# EAGLE design Adafruit DPI Kippah (EAGLE 6.6.0)
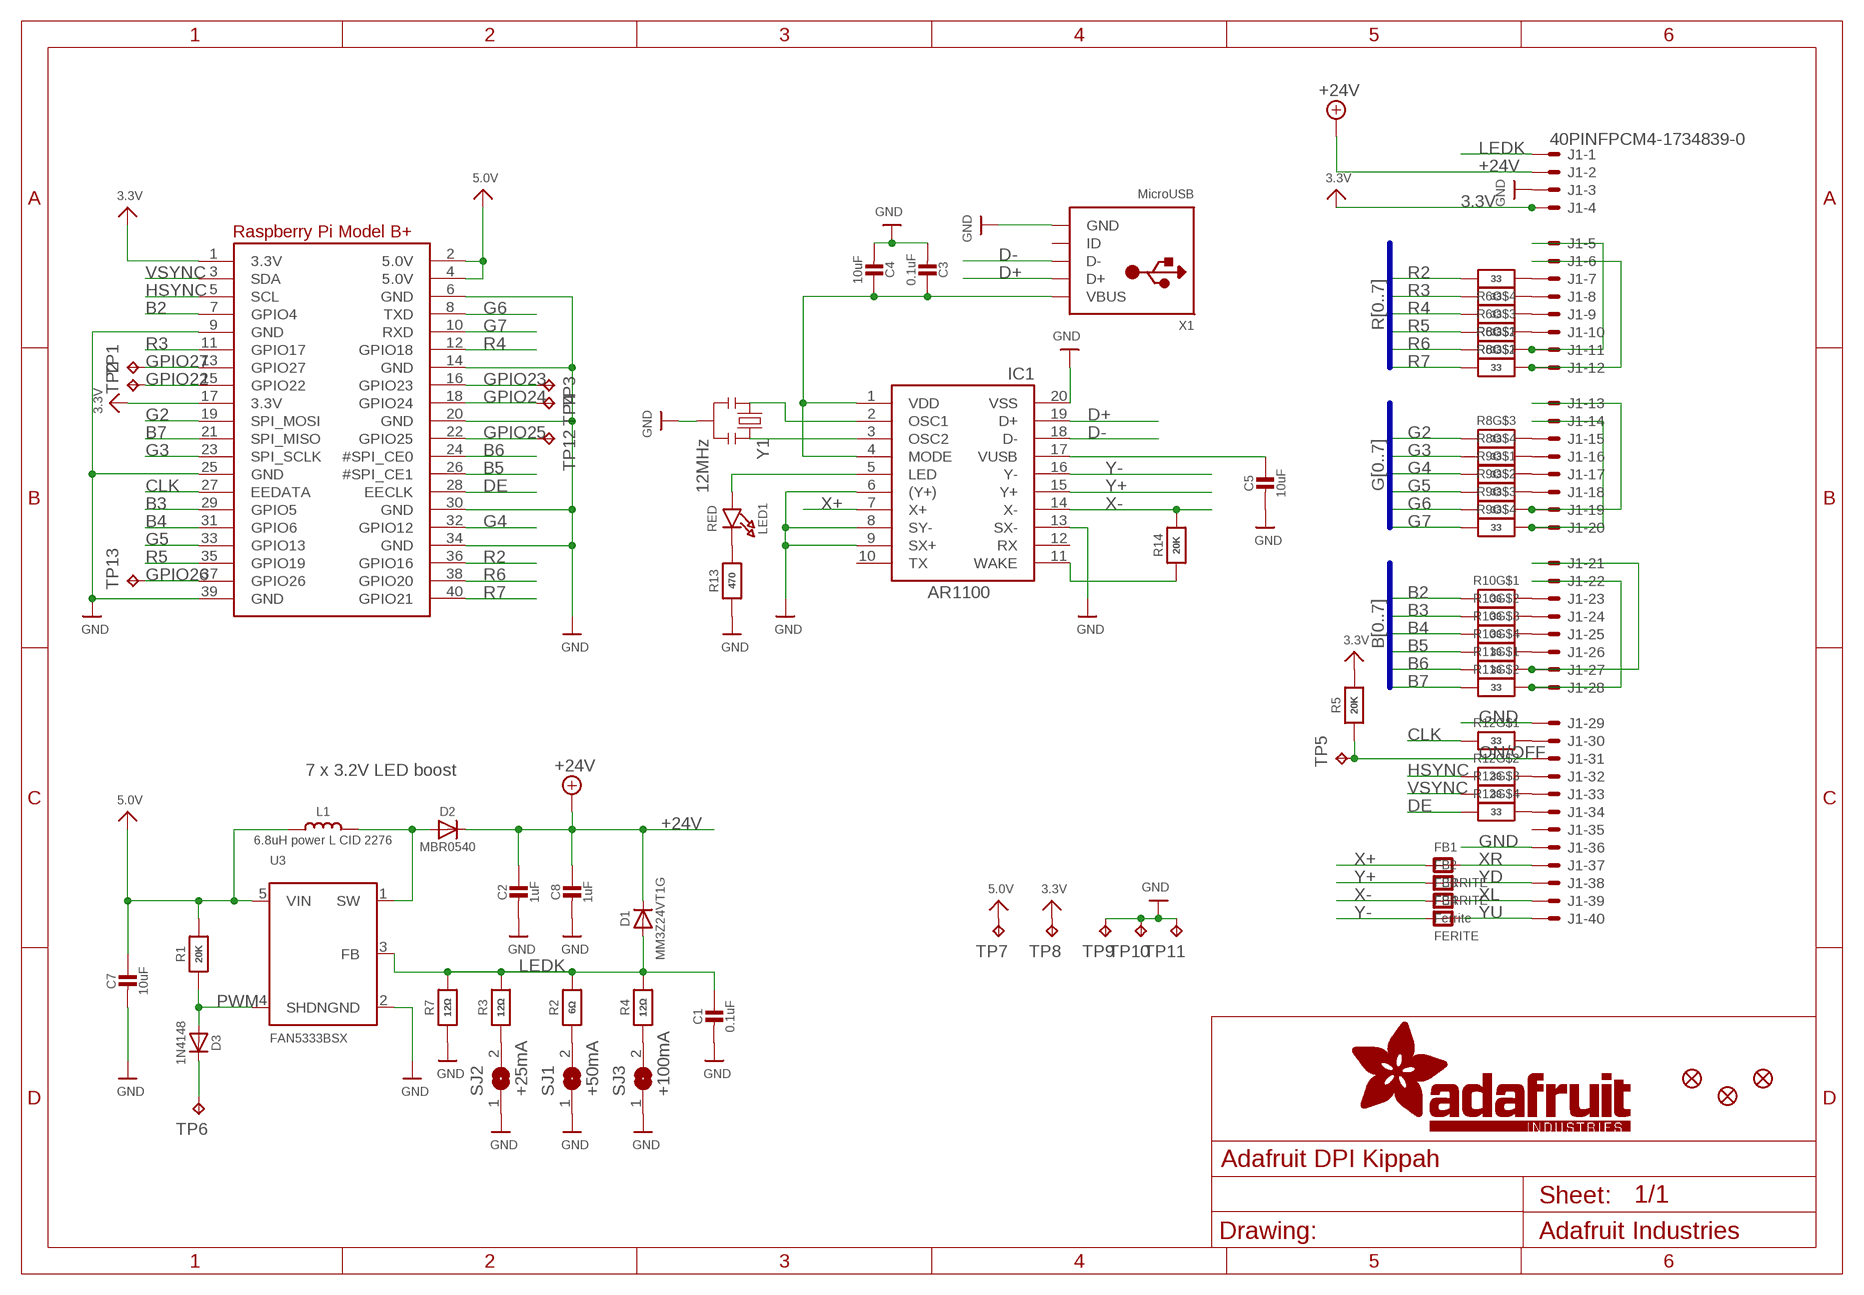
[diagram p0: schematic, sheet 1]

## Parts
C1  0.1uF  CAP_CERAMIC0805-NOOUTLINE  [0805-NO]
C2  1uF  CAP_CERAMIC_0805MP  [_0805MP]
C3  0.1uF  CAP_CERAMIC0805-NOOUTLINE  [0805-NO]
C4  10uF  CAP_CERAMIC0805-NOOUTLINE  [0805-NO]
C5  10uF  CAP_CERAMIC0805-NOOUTLINE  [0805-NO]
C7  10uF  CAP_CERAMIC0805-NOOUTLINE  [0805-NO]
C8  1uF  CAP_CERAMIC0805-NOOUTLINE  [0805-NO]
D1  MM3Z24VT1G  DIODESMA  [SMADIODE]
D2  MBR0540  DIODESOD-123  [SOD-123]
D3  1N4148  DIODESOD-323  [SOD-323]
FB1  FERRITE  FERRITE_0805MP  [_0805MP]
FB2  FERRITE  FERRITE_0805MP  [_0805MP]
FB3  Ferrite  FERRITE_0805MP  [_0805MP]
FB4  FERITE  FERRITE_0805MP  [_0805MP]
FID1  FIDUCIAL""  [FIDUCIAL_1MM]
FID2  FIDUCIAL""  [FIDUCIAL_1MM]
FID3  FIDUCIAL""  [FIDUCIAL_1MM]
IC1  AR1100_SSOP  [TSSOP20-5.3MMBODY]
J1  40PINFPCM4-1734839-0  [4-1734839-0]
L1  6.8uH power L CID 2276  INDUCTORNR5040  [INDUCTOR_5X5MM_NR5040_NOTHERMALS]
LED1  RED  LED0805_NOOUTLINE  [CHIPLED_0805_NOOUTLINE]
R1  20K  RESISTOR0805_NOOUTLINE  [0805-NO]
R2  6Ω  RESISTOR0805_NOOUTLINE  [0805-NO]
R3  12Ω  RESISTOR0805_NOOUTLINE  [0805-NO]
R4  12Ω  RESISTOR0805_NOOUTLINE  [0805-NO]
R5  20K  RESISTOR_0805MP  [_0805MP]
R6  33  RESISTOR_4PACK  [RESPACK_4X0603]
R7  12Ω  RESISTOR0805_NOOUTLINE  [0805-NO]
R8  33  RESISTOR_4PACK  [RESPACK_4X0603]
R9  33  RESISTOR_4PACK  [RESPACK_4X0603]
R10  33  RESISTOR_4PACK  [RESPACK_4X0603]
R11  33  RESISTOR_4PACK  [RESPACK_4X0603]
R12  33  RESISTOR_4PACK  [RESPACK_4X0603]
R13  470  RESISTOR0805_NOOUTLINE  [0805-NO]
R14  20K  RESISTOR0805_NOOUTLINE  [0805-NO]
RPI1  RASPBERRYPI_BPLUS-SMT+SLOTS  [PI_HAT_SMT_SLOTS]
SJ1  +50mA  SOLDERJUMPER  [SOLDERJUMPER_ARROW_NOPASTE]
SJ2  +25mA  SOLDERJUMPER  [SOLDERJUMPER_ARROW_NOPASTE]
SJ3  +100mA  SOLDERJUMPER  [SOLDERJUMPER_ARROW_NOPASTE]
TP1  TPTP15SQ  [TP15SQ]
TP2  TPTP15SQ  [TP15SQ]
TP3  TPTP15SQ  [TP15SQ]
TP4  TPTP15SQ  [TP15SQ]
TP5  TPTP15SQ  [TP15SQ]
TP6  TPTP15SQ  [TP15SQ]
TP7  TPTP15SQ  [TP15SQ]
TP8  TPTP15SQ  [TP15SQ]
TP9  TPTP15SQ  [TP15SQ]
TP10  TPTP15SQ  [TP15SQ]
TP11  TPTP15SQ  [TP15SQ]
TP12  TPTP15SQ  [TP15SQ]
TP13  TPTP15SQ  [TP15SQ]
U3  FAN5333BSX  FAN5331  [SOT23-5@1]
X1  MicroUSB  USBMICRO_20329  [4UCONN_20329]
Y1  12MHz  RESONATORSMD  [RESONATOR-SMD]

## Nets
3.3V: J1.4 R5.2 RPI1.1(3.3V) RPI1.17(3.3V) TP8.TP
5.0V: C7.1 L1.P$1 R1.2 RPI1.2(5.0V) RPI1.4(5.0V) TP7.TP U3.5(VIN)
+24V: C2.1 C8.1 D1.C D2.C J1.2
B2: R10.1 RPI1.7(GPIO4)
B3: R10.2 RPI1.29(GPIO5)
B4: R10.3 RPI1.31(GPIO6)
B5: R10.4 RPI1.26(#SPI_CE1)
B6: R11.1 RPI1.24(#SPI_CE0)
B7: R11.2 RPI1.21(SPI_MISO)
CLK: R12.1 RPI1.27(EEDATA)
D+: IC1.19(D+) X1.D+
D-: IC1.18(D-) X1.D-
DE: R12.4 RPI1.28(EECLK)
G2: R8.3 RPI1.19(SPI_MOSI)
G3: R8.4 RPI1.23(SPI_SCLK)
G4: R9.1 RPI1.32(GPIO12)
G5: R9.2 RPI1.33(GPIO13)
G6: R9.3 RPI1.8(TXD)
G7: R9.4 RPI1.10(RXD)
GND: C1.2 C2.2 C3.2 C4.2 C5.2 C7.2 C8.2 IC1.6((Y+)) IC1.8(SY-) IC1.9(SX+) IC1.13(SX-) IC1.20(VSS) J1.3 J1.29 J1.36 R7.1 R13.1 RPI1.6(GND) RPI1.9(GND) RPI1.14(GND) RPI1.20(GND) RPI1.25(GND) RPI1.30(GND) RPI1.34(GND) RPI1.39(GND) SJ1.1 SJ2.1 SJ3.1 TP9.TP TP10.TP TP11.TP U3.2(GND) X1.BASE@1(GND) X1.BASE@2(GND) X1.GND X1.SPRT@1(GND) X1.SPRT@2(GND) X1.SPRT@3(GND) X1.SPRT@4(GND) Y1.2
GPIO22: RPI1.15(GPIO22) TP2.TP
GPIO23: RPI1.16(GPIO23) TP3.TP
GPIO24: RPI1.18(GPIO24) TP4.TP
GPIO25: RPI1.22(GPIO25) TP12.TP
GPIO26: RPI1.37(GPIO26) TP13.TP
GPIO27: RPI1.13(GPIO27) TP1.TP
HSYNC: R12.2 RPI1.5(SCL)
LEDK: C1.1 D1.A J1.1 R2.2 R3.2 R4.2 R7.2 U3.3(FB)
N$1: R2.1 SJ1.2
N$2: R3.1 SJ2.2
N$3: R4.1 SJ3.2
N$4: J1.6 J1.12 R8.7
N$5: D2.A L1.P$2 U3.1(SW)
N$6: J1.5 J1.11 R8.8
N$7: J1.10 R6.1
N$8: J1.9 R6.2
N$9: J1.8 R6.3
N$10: J1.7 R6.4
N$11: J1.15 R8.6
N$12: J1.16 R8.5
N$13: J1.17 R9.8
N$14: J1.18 R9.7
N$15: J1.13 J1.19 R9.6
N$16: J1.14 J1.20 R9.5
N$17: J1.23 R10.8
N$18: J1.24 R10.7
N$19: J1.25 R10.6
N$20: J1.26 R10.5
N$21: J1.21 J1.27 R11.8
N$22: J1.22 J1.28 R11.7
N$23: J1.30 R12.8
N$24: J1.32 R12.7
N$25: J1.33 R12.6
N$26: J1.34 R12.5
N$27: D3.C TP6.TP
N$28: IC1.5(LED) LED1.A
N$29: LED1.C R13.2
N$31: IC1.11(WAKE) R14.1
N$33: IC1.3(OSC2) Y1.3
N$34: IC1.2(OSC1) Y1.1
ON/OFF: J1.31 R5.1 TP5.TP
PWM: D3.A R1.1 U3.4(SHDN)
R2: R6.5 RPI1.36(GPIO16)
R3: R6.6 RPI1.11(GPIO17)
R4: R6.7 RPI1.12(GPIO18)
R5: R6.8 RPI1.35(GPIO19)
R6: R8.1 RPI1.38(GPIO20)
R7: R8.2 RPI1.40(GPIO21)
VBUS: C3.1 C4.1 IC1.1(VDD) IC1.4(MODE) X1.VBUS
VSYNC: R12.3 RPI1.3(SDA)
VUSB: C5.1 IC1.17(VUSB)
X+: FB1.1 IC1.7(X+)
X-: FB3.1 IC1.14(X-) R14.2
XL: FB3.2 J1.39
XR: FB1.2 J1.37
Y+: FB2.1 IC1.15(Y+)
Y-: FB4.1 IC1.16(Y-)
YD: FB2.2 J1.38
YU: FB4.2 J1.40
Unconnected: IC1.10(TX) IC1.12(RX) J1.35 R11.3 R11.4 R11.5 R11.6 X1.ID

## Buses
R[0..7]
G[0..7]
B[0..7]

## Notes on the sheet
- 7 x 3.2V LED boost

## Library data of the parts
C1-C5 C7 C8 = microbuilder:CAP_CERAMIC: Ceramic Capacitors For new designs, use the packages preceded by an '_' character since they are more reliable: The following footprints should be used on most boards: _0402 - Standard footprint for regular board layouts _0603 - Standard footprint for regular board layouts _0805 - Standard footprint for regular board layouts _1206 - Standard footprint for regular board layouts For extremely tight-pitch boards where space is at a premium, the following 'micro-pitch' footprints can be used (smaller pads, no silkscreen outline, etc.): _0402MP - Micro-pitch footprint for very dense/compact boards _0603MP - Micro-pitch footprint for very dense/compact boards _0805MP - Micro-pitch footprint for very dense/compact boards _1206MP - Micro-pitch footprint for very dense/compact boards
D1-D3 = microbuilder:DIODE: Diode SMA Model Volts Amps Type Vf Ir Digikey # Notes SSA34-E3 40V 3A Schottky 480mV @ 3A 200uA @ 40V SSA34-E3/61TGITR-ND CDBA120-G 20V 1A Schottky 500mV @ 1A 500uA @ 20V 641-1014-6-ND REEL MBRA210 10V 2A Schottky 350mV @ 2A 700uA @ 10V MBRA210LT3 SOD-123 Model Volts Amps Type Vf Ir Order # Notes BAT54T1G 30V 200mA Schottky 800mV @ 200mA 2uA @ 25V BAT54T1GOSTR-ND B0530W 30V 500mA Schottky 430mV @ 500mA 130uA @ 30V B0530W-FDICT-ND REEL MBR120 20V 1A Schottky 340mV @ 1A MBR120VLSFT1GOSCT-ND SOD-323 Model Volts Amps Type Vf Ir Order # Notes PMEG2005EJ 20V 500mA Schottky 355mV @ 500mA 568-4110-1-ND ZLLS410 10V 570mA Schottky 380mV @ 570mA ZLLS410CT-ND 1N4148WS 75V 150mA Silicon/Simple 1V 1N4148WSFSCT-ND REEL SOD-523 Model Volts Amps Type Vf Ir Order # Notes BAT54XV2 30V 200mA Schottky 0.8V @ 100mA BAT54XV2CT-ND TB751S 30V 30mA Schottky RB751S-40TE61CT-ND SOT23-R/W (R = Solder Paste/Reflow Ovens, W = Hand-Soldering) Model Volts Amps Type Vf Ir Order # Notes BAT54FILM 40V 300mA Schottky 497-7162-1-ND POWERDI-5 Model Volts Amps Type Vf Ir Order # Notes PDS560 60V 5A Schottky 670mV @ 5A 150uA @ 60V PDS560DICT-ND
FB1-FB4 = microbuilder:FERRITE: Ferrite Bead 0603 MMZ1608B121C - 120 Ohm @ 100MHz, 600mA, 0.15 Ohm DC Resistance - Digikey: 445-2164-1-ND BK1608HW121-T - 120 Ohm, 600mA Ferrite Chip - Digikey: 587-1876-2-ND 0805 HZ0805B272R-10 - 2.7K Ohm @ 100MHz, 200mA, 0.8 Ohm DC Resistance - Digikey: 240-2504-1-ND (see also Murata BLM21BD272SN1L) MMZ2012Y152B - 1.5K Ohm @ 100MHz, 500mA, 0.4 Ohm DC Resistance - Digikey: 445-1560-1-ND - Mainly for high frequency (80-400MHz) MMZ2012R102A - 1K Ohm @ 100MHz, 500mA, 0.3 Ohm DC Resistance - Digikey: 445-1555-2-ND - More general purpose (10-200MHz)
FID1-FID3 = microbuilder:FIDUCIAL: Fiducial Alignment Points Various fiducial points for machine vision alignment.; BOM: EXCLUDE
IC1 = microbuilder:AR1100
J1 = adafruit:40PINFPC: OMRON FPC Connector Source : http://www.omron.com/ecb/products/pdf/fpc.pdf XF2M-4015-rev is good for connecting up 'PSP' SHARP LQ043 LCDs
L1 = microbuilder:INDUCTOR: Inductors 0603: 10nH Ceramic Inductor - microwire antenna/RF (Digikey: 712-1434-2-ND) 0805: 560nH Ceramic Inductor - RF (Digikey: 553-1047-1-ND) 270nH Ceramic Inductor - Q = 40@250MHz, +-5%, 1 Ohm DC Resistance (Digikey: 535-10506-2-ND) 1007 (2518 Metric) SMT: 10µH 10% 250mOhm 820mA 1007 Inductor (Digikey: 587-2189-1-ND) 22µH 10% 500mOhm 580mA 1007 Inductor (Digikey: 587-2190-1-ND) 47µH 10% 950mOhm 420mA 1007 Inductor (Digikey: 587-2191-1-ND) 47µH 5% 100mOhm 1A 1008 Inductor (Digikey: 732-1816-1-ND) 5.0x5.0mm (Taiyo Yuden NR5040 Series) 6.8µH 20% 2.3A 64mOhm Inductor (Digikey: 587-2374-2-ND) 5.0x5.0mm (TDK VLC5045 Series) 4.7µH 20% 3.3A 34mOhm Inductor (Digikey: 445-6526-1-ND) 6.8µH 20% 2.7A 46mOhm Inductor (Digikey: 445-6527-1-ND) 6.0x6.0mm (TDK VLC6045 Series) 4.7µH 20% 3.8A 27mOhm Inductor (Digikey: 445-6538-2-ND) 6.8µH 20% 3A 41mOhm Inductor (Digikey: 445-6540-1-ND) 6.2µH 30% 2.2A 45mOhm Inductor (Digikey: SRR5028-6R2YCT-ND) - Not TDK VLC6045 but footprint should match 6.0x6.0mm (TDK SLF6045 Series) 6.8uH 30% 2A 33mOhm Inductor (Digikey: 445-4572-1-ND, Mouser: 810-SLF645T6R8N2R0PF) 6.0x6.0mm (Sumida CDRH5D28 Series) 6.2uH 30% 1.8A 45mOhm Inductor (Digikey: 308-1542-1-ND) Taiyo Yuden NR3015T2R2M - 2.2uH 20% 1.5A (Digikey: 587-1648-2-ND, Mouser: 963-NR3015T2R2M) - Used with TI TPS62172 CoilCraft RFID Transponder Coil - MA5532-AE (For use with AS3935 Lightning Sensor) Vishay IHLP 1.0uH Molded Inductor - 24mOhm DCR, 5A, +/-20%, -55°C-125°C (Digikey: 541-1319-1-ND)
LED1 = microbuilder:LED: LED 0603 - 0603 Surface Mount Package 2mA: Green LED - Low Power (3.9mcd, 2ma, 1.7Vf) - Digikey: 475-2709-2-ND Orange LED - Low Power (9.8mcd, 2ma, 1.8Vf) - Digikey: 475-1194-2-ND Red LED - Low Power (5mcd, 2ma, 1.8Vf) - Digikey: 475-1195-2-ND Yellow LED - Low Power (7mcd, 2ma, 1.8Vf) - Digikey: 475-1196-2-ND 5mA: Blue LED - Low Power (17mcd, 5ma, 2.9Vf) - Digikey: LNJ937W8CRACT-ND 0805 - 0805 Surface Mount Package 2mA: Red LED (8.8mcd, 2mA, 1.8Vf, Clear) - Low Power [Digikey: 475-2510-1-ND] Green LED (5mcd, 2mA, 1.8Vf, Clear) - Low Power [Digikey: 475-2730-1-ND] Yellow LED (11.3mcd, 2mA, 1.8Vf, Clear) - Low Power [Digikey: 475-2555-1-ND] 20mA: Red LED (104mcd, 20mA, Diffused) - LS R976 [Digikey: 475-1278-6-ND] Red LED (12mcd, 20mA, 2.0Vf, Clear) - APT2012EC [Digikey: 754-1128-1-ND] Green LED (15mcd, 20mA, 2.2Vf, Clear) - APT2012GC [Digikey: 754-1131-1-ND] Orange LED (160mcd, 20mA, 2.1Vf, Clear) - APT2012SECK [Digikey: 754-1130-1-ND] 1206 - 1206 Surface Mount Package Green LED (26mcd, 20mA, Diffused) - LG N971 [Digikey: 475-1407-6-ND] Red LED (15mcd, 20mA, Diffused) - LH N974 [Digikey: 475-1416-6-ND] Cree - Cree High-Power Surface Mount LEDs XPEBWT-L1-0000-00D50 - White 111lm 350mA 2.9Vf 6200K 110° XTEAWT-00-0000-00000LEE3 - White 114lm 350mA 2.85Vf 5000K 115° Everlight - Everlight 45-21 Series Surface Mount LEDs 45-21/QK2C-B2832AC2CB2/2T - Warm White 2000mcd 20mA 3.25Vf 3050K 120° 45-21/LK2C-B38452C4CB2/2T - Nuetral White 2000mcd 20mA 3.25Vf 4150K 120° 45-21/LK2C-B50634C6CB2/2T - Cold White 2200mcd 20mA 3.25Vf 5650K 120° PLCC2 Reverse Mount LS T77K-J1L2-1-0-2-R18-Z - Red 11.25mcd 2mA 1.8Vf 630nm 120° LO T77K-L1M2-24-Z - Orange 19.6mcd 2mA 1.8Vf 606nm 120° LY T77K-K2M1-26-Z - Yellow 15.7mcd 2mA 1.8Vf 587nm 120°
R1-R5 R7 R13 R14 = microbuilder:RESISTOR: Resistors For new designs, use the packages preceded by an '_' character since they are more reliable: The following footprints should be used on most boards: _0402 - Standard footprint for regular board layouts _0603 - Standard footprint for regular board layouts _0805 - Standard footprint for regular board layouts _1206 - Standard footprint for regular board layouts For extremely tight-pitch boards where space is at a premium, the following 'micro-pitch' footprints can be used (smaller pads, no silkscreen outline, etc.): _0402MP - Micro-pitch footprint for very dense/compact boards _0603MP - Micro-pitch footprint for very dense/compact boards _0805MP - Micro-pitch footprint for very dense/compact boards _1206MP - Micro-pitch footprint for very dense/compact boards
R6 R8-R12 = microbuilder:RESISTOR_4PACK: Resistor Packs (4 resistors) 4 x 0603 10K 1/16W - Digikey: YC164J-10KCT-ND
RPI1 = microbuilder:RASPBERRYPI_BPLUS
SJ1-SJ3 = microbuilder:SOLDERJUMPER: SMD Solder JUMPER Solder the two pads together to create a connection, or remove the solder to break it. REFLOW - Use this footprint for solder paste and reflow ovens. WAVE - Use this footprint for hand-soldering (larger pads). CLOSED - Has a trace between the two pads to ensure it is closed by default. The trace needs to be cut to disable the jumper, and can be closed again by creating a solder bridge between the two pads.; BOM: EXCLUDE
TP1-TP13 = testpad:TP: Test pad
U3 = microbuilder:FAN5331: FAN5331 - LED/OLED 20V Boost Converter Digikey: FAN5331SXCT-ND
X1 = microbuilder:USB: USB Connectors USBMINIB - Surface Mount Female Mini-B USB Connector 4UConnector: 06564
Y1 = SparkFun:RESONATOR: Resonator Small SMD resonator. This is the itty bitty 10/20MHz resonators with built in caps. CSTCE10M0G55 and CSTCE20M0V53. Footprint has been reviewed closely but hasn't been tested yet.

## Board
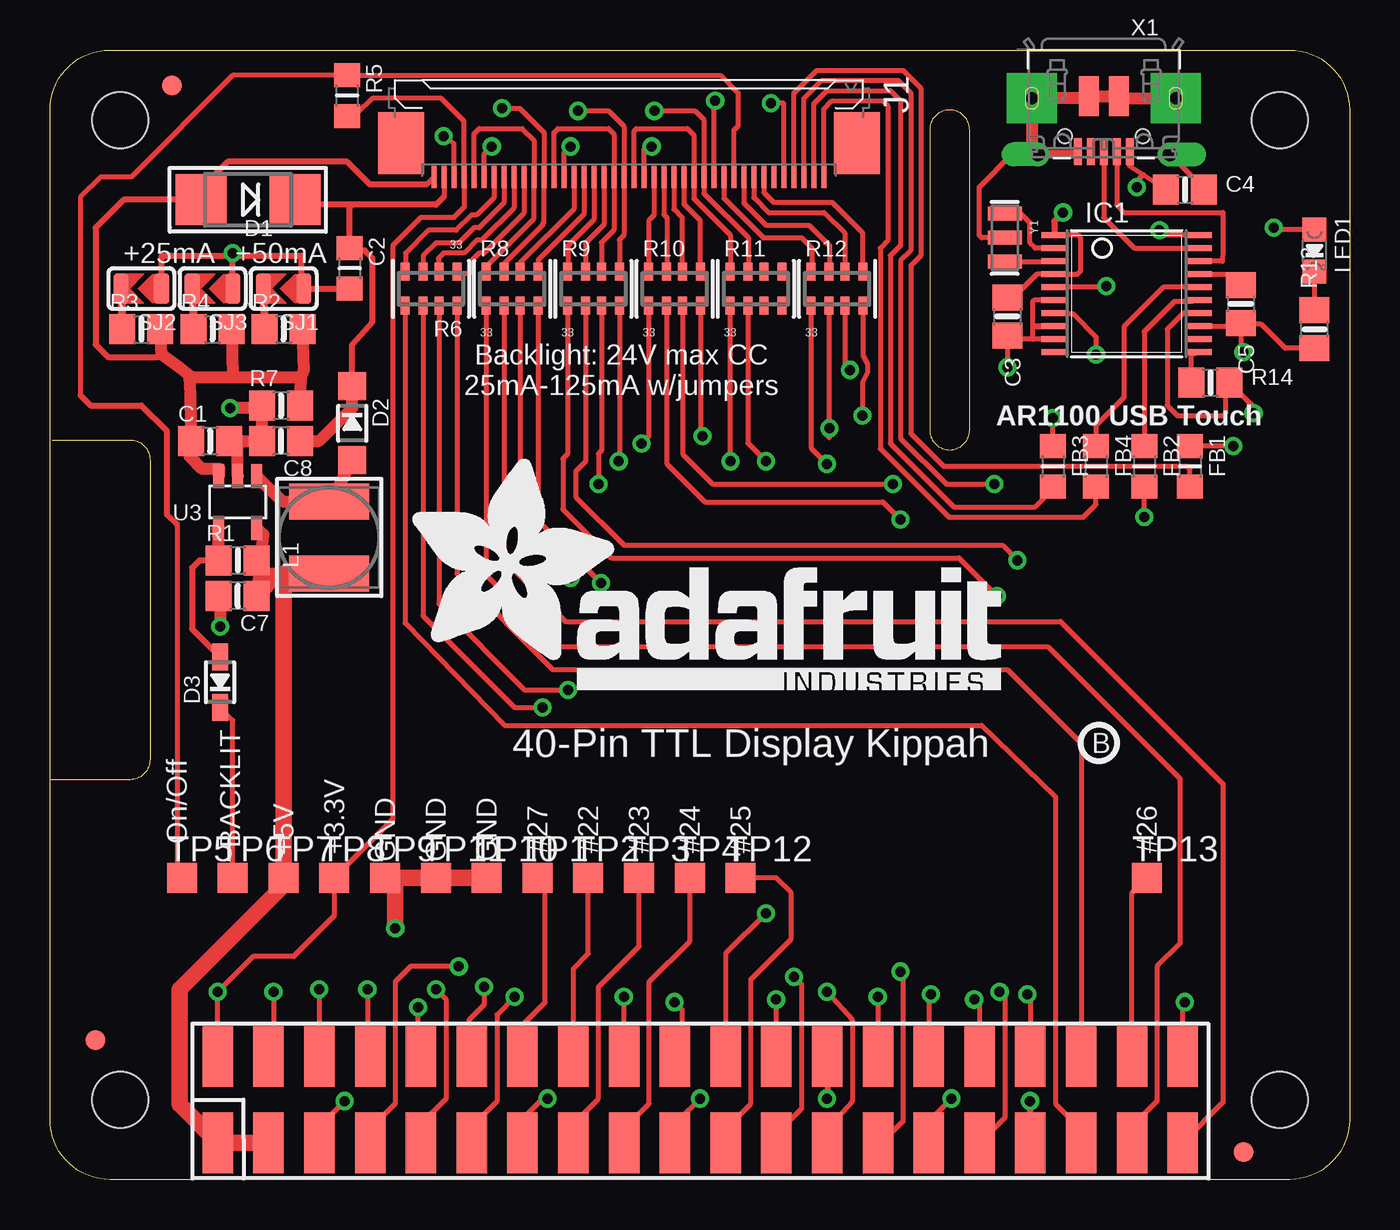
[diagram p1: board, top side]
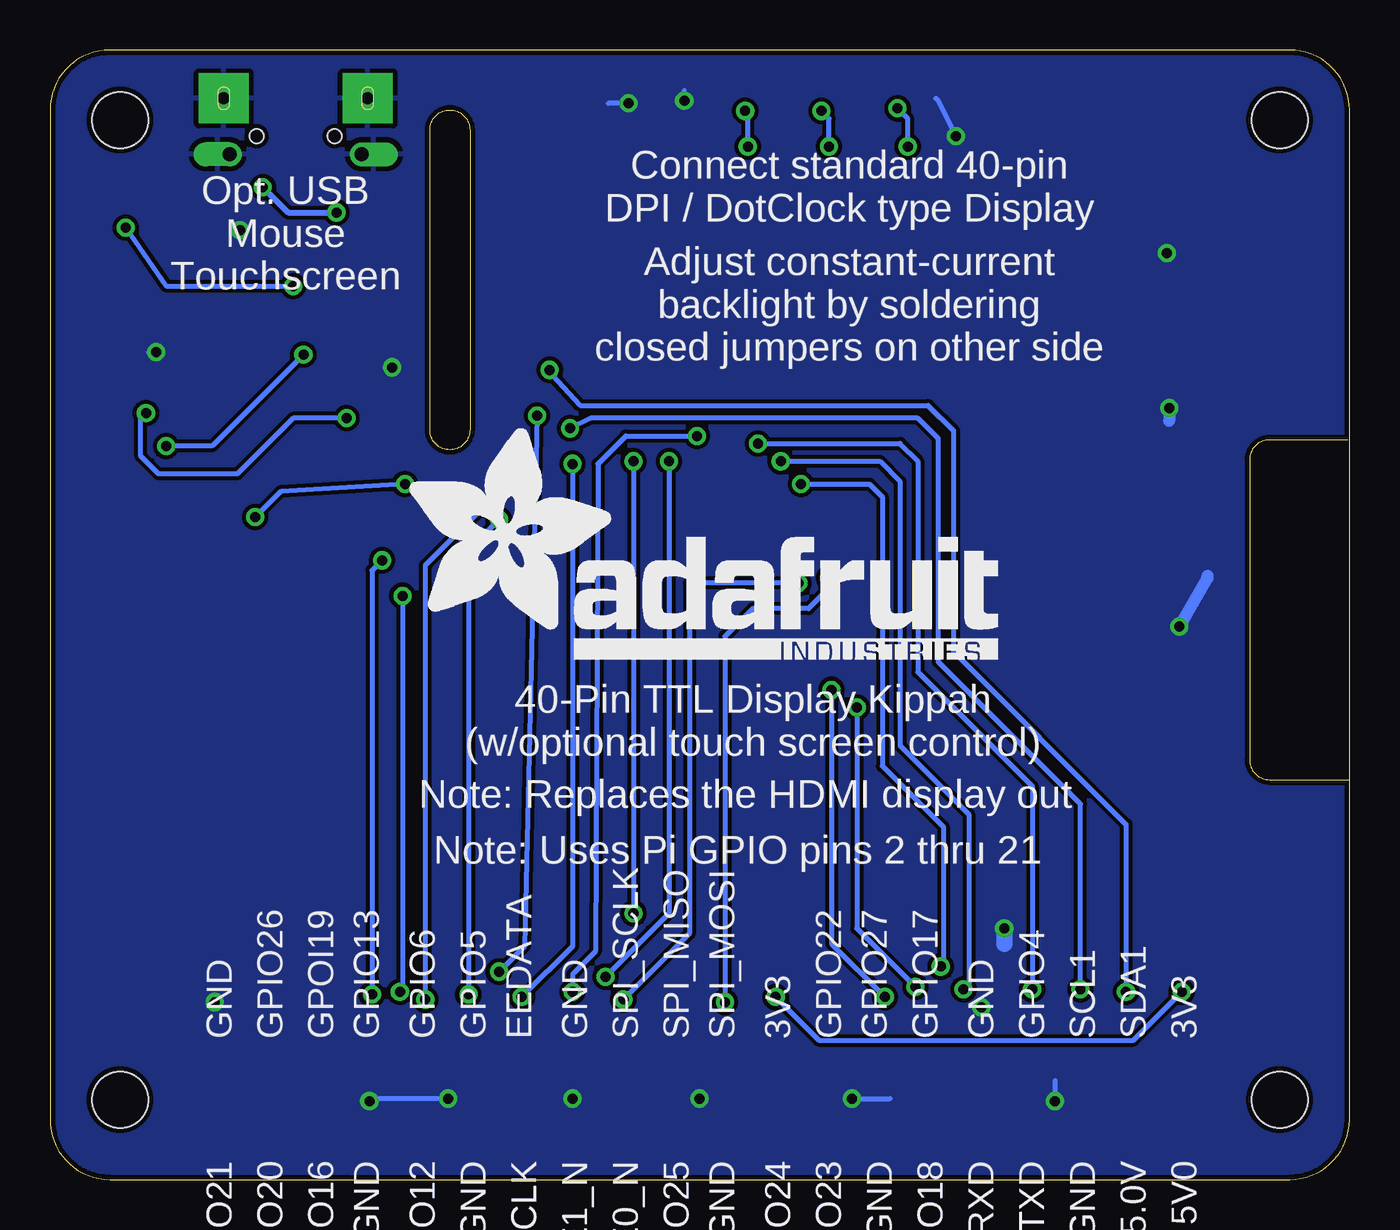
[diagram p2: board, bottom side, seen from below]

Size 65 x 56.5 mm. Coordinates in mm from the lower left corner, seen from the top.
Copper layers (1*16): Top 0.035mm / dielectric 1.5mm / Bottom 0.035mm
Design rules "adafruit": minimum track width 8mil, minimum drill 15.5mil, track to track 8mil, track to pad 8mil, pad to pad 8mil, via to via 8mil, smd to smd 8mil, copper to edge 10mil, drill to drill 8mil, minimum pad ring 10mil, minimum via ring 8mil, stop-mask expansion 4mil, vias tented up to drill 20mil, thermal gap 10mil

### Footprints (pad centres in the part's own frame; a part is rotated, then mirrored left to right if it is on the bottom)
0805-NO = smd 1.3 x 1.5: 1 -0.95,0; 2 0.95,0
_0805MP = smd 1.2 x 1.3: 1 -1.016,0; 2 1.016,0
SMADIODE = smd 2.54 x 2.54: A 2.349,0; C -2.349,0
SOD-123 = smd 1.4 x 1.4: A 1.85,0; C -1.85,0
SOD-323 = smd 1.35 x 0.8: A 1.27,0; C -1.27,0
FIDUCIAL_1MM = smd 1 x 1: 1 0,0
TSSOP20-5.3MMBODY = smd 0.305 x 1.27: 1 -2.925,-3.618; 2 -2.275,-3.618; 3 -1.625,-3.618; 4 -0.975,-3.618; 5 -0.325,-3.618; 6 0.325,-3.618; 7 0.975,-3.618; 8 1.625,-3.618; 9 2.275,-3.618; 10 2.925,-3.618; 11 2.925,3.618; 12 2.275,3.618; 13 1.625,3.618; 14 0.975,3.618; 15 0.325,3.618; 16 -0.325,3.618; 17 -0.975,3.618; 18 -1.625,3.618; 19 -2.275,3.618; 20 -2.925,3.618
4-1734839-0 = smd 0.25 x 1.1: 1 -9.75,-2.54; 2 -9.25,-2.54; 3 -8.75,-2.54; 4 -8.25,-2.54; 5 -7.75,-2.54; 6 -7.25,-2.54; 7 -6.75,-2.54; 8 -6.25,-2.54; 9 -5.75,-2.54; 10 -5.25,-2.54; 11 -4.75,-2.54; 12 -4.25,-2.54; 13 -3.75,-2.54; 14 -3.25,-2.54; 15 -2.75,-2.54; 16 -2.25,-2.54; 17 -1.75,-2.54; 18 -1.25,-2.54; 19 -0.75,-2.54; 20 -0.25,-2.54; 21 0.25,-2.54; 22 0.75,-2.54; 23 1.25,-2.54; 24 1.75,-2.54; 25 2.25,-2.54; 26 2.75,-2.54; 27 3.25,-2.54; 28 3.75,-2.54; 29 4.25,-2.54; 30 4.75,-2.54; 31 5.25,-2.54; 32 5.75,-2.54; 33 6.25,-2.54; 34 6.75,-2.54; 35 7.25,-2.54; 36 7.75,-2.54; 37 8.25,-2.54; 38 8.75,-2.54; 39 9.25,-2.54; 40 9.75,-2.54 | smd 2.3 x 3.1: M1 11.4,-0.84; M2 -11.4,-0.84
INDUCTOR_5X5MM_NR5040_NOTHERMALS = smd 1.8 x 4: P$1 -1.8,0; P$2 1.8,0
CHIPLED_0805_NOOUTLINE = smd 1.2 x 1.2: A 0,-1.05; C 0,1.05
RESPACK_4X0603 = smd 0.45 x 0.9: 1 -1.3,-0.85; 2 -0.4,-0.85; 3 0.4,-0.85; 4 1.3,-0.85; 5 1.3,0.85; 6 0.4,0.85; 7 -0.4,0.85; 8 -1.3,0.85
PI_HAT_SMT_SLOTS = smd 1.524 x 3.048 bottom: 1 8.395,50.349; 2 8.395,54.667; 3 10.935,50.349; 4 10.935,54.667; 5 13.475,50.349; 6 13.475,54.667; 7 16.015,50.349; 8 16.015,54.667; 9 18.555,50.349; 10 18.555,54.667; 11 21.095,50.349; 12 21.095,54.667; 13 23.635,50.349; 14 23.635,54.667; 15 26.175,50.349; 16 26.175,54.667; 17 28.715,50.349; 18 28.715,54.667; 19 31.255,50.349; 20 31.255,54.667; 21 33.795,50.349; 22 33.795,54.667; 23 36.335,50.349; 24 36.335,54.667; 25 38.875,50.349; 26 38.875,54.667; 27 41.415,50.349; 28 41.415,54.667; 29 43.955,50.349; 30 43.955,54.667; 31 46.495,50.349; 32 46.495,54.667; 33 49.035,50.349; 34 49.035,54.667; 35 51.575,50.349; 36 51.575,54.667; 37 54.115,50.349; 38 54.115,54.667; 39 56.655,50.349; 40 56.655,54.667 | hole 2.8: 3.5,3.5; 3.5,52.5; 61.5,52.5; 61.5,3.5
SOLDERJUMPER_ARROW_NOPASTE = smd 0.762 x 1.524: 1 -1.016,0; 2 1.016,0
TP15SQ = smd 1.5 x 1.5: TP 0,0
SOT23-5@1 = smd 0.55 x 1.2: 1 -0.95,-1.3; 2 0,-1.3; 3 0.95,-1.3; 4 0.95,1.3; 5 -0.95,1.3
4UCONN_20329 = smd 1 x 2: BASE@1 -0.75,-2; BASE@2 0.75,-2 | smd 0.4 x 1.35: D+ 0,0.775; D- -0.65,0.775; GND 1.3,0.775; ID 0.65,0.775; VBUS -1.3,0.775 | drill 0.7 offset: SPRT@1 -3.3,0.9; SPRT@2 3.3,0.9 | drill 0.6 pad 2.5 square: SPRT@3 -3.6,-1.9; SPRT@4 3.6,-1.9 | hole 0.7: -1.95,0; 1.95,0
RESONATOR-SMD = smd 0.7 x 1.7: 1 -1.2,0; 2 0,0; 3 1.2,0

### Placement (x,y rotation side)
C1  8,36.94 0 top
C2  14.99,45.58 270 top
C3  47.88,43.16 270 top
C4  56.77,49.52 0 top
C5  59.56,43.8 270 top
C7  9.4,29.2 180 top
C8  11.56,36.94 180 top
D1  9.91,49.01 180 top
D2  15.11,37.83 270 top
D3  8.51,24.88 90 top
FB1  57.02,35.67 270 top
FB2  54.74,35.67 270 top
FB3  50.16,35.67 270 top
FB4  52.32,35.67 270 top
FID1  59.69,1.38 0 top
FID2  2.29,6.97 0 top
FID3  6.1,54.72 0 top
IC1  53.85,44.31 270 top
J1  28.96,52.69 0 top
L1  13.97,32.12 90 top
LED1  63.25,46.47 180 top
R1  9.4,30.97 0 top
R2  11.68,42.53 0 top
R3  4.57,42.53 0 top
R4  8.13,42.53 0 top
R5  14.86,54.21 270 top
R6  19.05,44.56 180 top
R7  11.56,38.72 0 top
R8  23.11,44.56 0 top
R9  27.18,44.56 0 top
R10  31.24,44.56 0 top
R11  35.31,44.56 0 top
R12  39.37,44.56 0 top
R13  63.25,42.53 90 top
R14  58.04,39.86 0 top
RPI1  0,56.5 180 bottom
SJ1  11.68,44.56 180 top
SJ2  4.57,44.56 180 top
SJ3  8.13,44.56 180 top
TP1  24.38,15.1 0 top
TP2  26.92,15.1 0 top
TP3  29.46,15.1 0 top
TP4  32,15.1 0 top
TP5  6.6,15.1 0 top
TP6  9.14,15.1 0 top
TP7  11.68,15.1 0 top
TP8  14.22,15.1 0 top
TP9  16.76,15.1 0 top
TP10  21.84,15.1 0 top
TP11  19.3,15.1 0 top
TP12  34.54,15.1 0 top
TP13  54.86,15.1 0 top
U3  9.4,33.89 180 top
U$30  [ADAFRUIT_TEXT_30MM]  17.91,24.5 0 top
U$31  [ADAFRUIT_TEXT_30MM]  47.24,26.02 0 bottom
U$32  [PCBFEAT-REV-040]  52.45,21.83 0 top
X1  52.7,52.18 180 top
Y1  47.75,47.1 270 top

### Tracks (layer width: path | path; a pad name or v marks a point on that pad's centre or on a via)
3.3V  (via drill 0.5)
  Top 0.254: RPI1.1 v8.39,9.38 10.17,11.16 12.19,11.16 14.22,13.19 TP8.TP 17.14,18.02 17.14,46.72 18.54,48.12 20.19,48.12 20.71,48.63 J1.4 20.71,52.94 19.56,54.09 16.13,54.09 15.37,53.33 14.99,53.33 R5.2 | RPI1.17 28.71,9.12 v28.7,9.13
  Bottom 0.254: v28.7,9.13 26.54,6.97 10.81,6.97 v8.39,9.38
5.0V
  Top 0.61: 10.9,30.32 C7.1 10.67,32.27 U3.5 | 10.9,30.32 L1.P$1 | 10.9,30.32 10.41,30.8 R1.2
  Top 0.813: RPI1.4 RPI1.2 6.48,3.75 6.48,9.51 11.68,14.72 TP7.TP 11.68,30.32 L1.P$1 | 10.92,29.83 C7.1
+24V
  Top 0.254: J1.2 19.71,49.16
  Top 0.305: 19.71,49.16 19.3,48.75 15.11,48.75 | 15.11,48.75 12.51,48.75 D1.C | 15.11,48.75 14.99,48.63 C2.1 15.11,46.47 15.75,46.47 16.13,46.09 16.13,42.91 15.11,41.77 D2.C
  Top 0.61: C8.1 13.46,36.94 15.11,38.59 D2.C
B2  (via drill 0.5)
  Top 0.254: R10.1 29.94,37.17 v29.59,36.81 | v15.88,9.51 15.88,6.29 RPI1.7
  Bottom 0.254: v29.59,36.81 22.48,36.81 21.59,35.93 21.59,25.38 15.88,19.67 v15.88,9.51
B3  (via drill 0.5)
  Top 0.254: R10.2 30.84,35.82 32.77,33.89 41.66,33.89 v42.55,33.01 | v44.07,9.26 43.95,9.14 RPI1.29
  Bottom 0.254: v42.55,33.01 44.07,31.48 v44.07,9.26
B4  (via drill 0.5)
  Top 0.254: R10.3 31.64,36.29 33.15,34.78 v42.16,34.78 | v46.23,9 46.49,8.73 RPI1.31
  Bottom 0.254: v42.16,34.78 46.23,30.72 v46.23,9
B5  (via drill 0.5)
  Top 0.254: R10.4 32.54,37.29 v32.64,37.2 | v38.86,9.38 40.13,7.99 40.13,3.92 38.86,2.52 38.86,1.85 RPI1.26
  Bottom 0.254: v38.86,9.38 38.86,10.27 37.72,11.41 37.59,35.8 36.2,37.2 v32.64,37.2
B6  (via drill 0.5)
  Top 0.254: R11.1 34.01,35.96 v34.04,35.93 | v37.21,10.14 37.59,9.76 37.59,3.54 36.34,2.28 RPI1.24
  Bottom 0.254: v34.04,35.93 34.04,13.32 v37.21,10.14
B7  (via drill 0.5)
  Top 0.254: R11.2 34.91,36.83 v35.81,35.93 | v35.81,13.32 33.8,11.3 RPI1.21
  Bottom 0.254: v35.81,35.93 v35.81,13.32
CLK  (via drill 0.5)
  Top 0.254: R12.1 38.07,36.59 v38.86,35.8 | v41.4,9.13 RPI1.27
  Bottom 0.254: v38.86,35.8 38.86,11.67 v41.4,9.13
D+
  Top 0.254: X1.D+ 52.7,48.12 54.23,46.59 57.2,46.59 IC1.19
D-
  Top 0.254: X1.D- 53.35,48.74 53.72,48.37 58.67,48.37 58.67,46.47 58.65,45.93 IC1.18
DE  (via drill 0.5)
  Top 0.254: R12.4 40.67,41.23 40.89,40.75 40.89,40.37 40.64,39.86 v40.64,38.21 | v42.55,10.4 42.67,10.27 42.67,2.91 41.6,1.83 RPI1.28
  Bottom 0.254: v40.64,38.21 41.27,11.67 v42.55,10.4
G2  (via drill 0.5)
  Top 0.254: R8.3 23.51,32.6 v26.04,30.08 | v31.24,8.88 31.62,8.49 31.62,5.57 31.25,5.94 RPI1.19
  Bottom 0.254: v26.04,30.08 26.04,29.58 27.05,28.56 29.84,28.56 31.24,27.16 v31.24,8.88
G3  (via drill 0.5)
  Top 0.254: R8.4 24.41,32.98 v27.56,29.83 | v36.32,9 36.32,6.16 RPI1.23
  Bottom 0.254: v27.56,29.83 33.02,29.83 33.02,12.3 v36.32,9
G4  (via drill 0.5)
  Top 0.254: R9.1 25.88,36.28 25.65,36.05 25.65,33.51 28.07,31.1 45.47,31.1 v47.37,29.2 | v47.5,9.38 47.75,9.13 47.75,3.09 RPI1.32
  Bottom 0.254: v47.37,29.2 47.37,9.51 v47.5,9.38
G5  (via drill 0.5)
  Top 0.254: R9.2 26.78,35.91 26.29,35.42 26.29,34.15 28.7,31.73 47.62,31.73 v48.39,30.97 | v48.9,9.26 49.03,9.12 RPI1.33
  Bottom 0.254: v48.9,9.26 48.9,30.46 v48.39,30.97
G6  (via drill 0.5)
  Top 0.254: R9.3 27.58,36.45 27.43,36.31 v27.43,34.78 | v20.45,10.65 18.03,10.65 17.27,9.89 17.27,3.79 16.02,2.54 RPI1.8
  Bottom 0.254: v27.43,34.78 24,34.78 23.37,34.15 23.37,20.69 20.32,17.64 20.32,10.78 v20.45,10.65
G7  (via drill 0.5)
  Top 0.254: R9.4 28.48,35.96 v28.45,35.93 | v19.3,9.51 19.81,9 19.81,4.05 18.41,2.65 18.41,1.38 18.55,1.52 RPI1.10
  Bottom 0.254: v28.45,35.93 23.5,35.93 22.48,34.91 22.48,21.7 19.05,18.27 19.05,9.76 v19.3,9.51
GND  (via drill 0.5)
  Top 0.254: J1.29 33.21,53.9 v33.27,53.96 | RPI1.14 23.64,3.05 24.64,4.05 v24.89,4.05 | RPI1.20 31.11,1.97 31.11,3.03 31.5,3.03 v32.51,4.05 | RPI1.9 18.41,6.29 v18.41,8.62 | v14.73,3.92 13.47,2.66 RPI1.6 | RPI1.30 43.95,2.92 v45.09,4.05 | RPI1.39 56.66,8.76 v56.77,8.88 | J1.36 36.71,53.83 v36.07,53.83 | J1.3 20.21,51.81 v19.68,52.18 | IC1.13 59.4,42.68 C5.2 | C5.2 59.56,41.77 v59.69,41.39 | R13.1 61.78,41.58 60.58,42.78 59.63,42.78 C5.2 | IC1.20 55.75,47.23 v55.5,47.48 | Y1.2 46.61,47.1 46.48,47.23 46.48,49.64 48.12,51.28 X1.SPRT@2 | C4.2 57.08,50.2 X1.SPRT@1 | IC1.6 49.2,43.98 49.15,43.93 49.15,42.78 49.28,42.66 50.2,42.66 IC1.8 49.15,42.68 49.15,42.03 | IC1.9 49.15,42.03 | 49.15,42.03 48.06,42.03 C3.2 v47.88,40.62
  Top 0.305: SJ3.1 9.14,46.21 | 9.14,46.21 12.57,46.21 12.57,44.56 SJ1.1 C2.2 | SJ2.1 5.59,46.21 9.14,46.21 | 9.14,46.21 v9.14,46.34 | RPI1.25 38.88,4.19 v38.86,4.05 | v49.02,3.92 RPI1.34
  Top 0.406: X1.GND 51.28,51.28 X1.SPRT@2
  Top 0.61: C1.2 9.4,36.94 | U3.2 9.4,36.94 | 9.4,36.94 C8.2 R7.1 10.41,38.59 v9.02,38.59 | C7.2 8.51,29.45 v8.51,27.67 | X1.SPRT@2 49.15,51.54 49.15,54.09 | X1.SPRT@3 53.55,54.08 X1.BASE@1 X1.BASE@2 51.86,54.09 49.15,54.09 | 49.02,54.09 49.15,54.09
  Top 0.813: TP9.TP 17.27,15.1 | 17.27,15.1 TP11.TP TP10.TP | 17.27,15.1 v17.27,12.56
  Bottom 0.254: v33.27,53.96 33.27,54.47 | 14.73,4.94 v14.73,3.92 | v24.89,4.05 22.99,4.05 | v45.09,4.05 49.02,4.05 | v56.77,8.88 56.77,9.26 | v36.07,53.83 37.08,53.83 | v19.68,52.18 20.57,53.96 20.7,54.09 | v59.69,41.39 60.07,41.39 | v55.5,47.48 55.24,47.48 55.12,47.61 | v47.88,40.62 47.88,40.37
  Bottom 0.61: v9.02,38.59 9.02,37.96 | v8.51,27.67 7.11,30.08 7.11,30.21
  Bottom 0.813: v17.27,12.56 17.27,11.8
  pour Bottom: -0.89,57.01 -0.89,-0.14 65.15,-0.14 65.15,57.01
GPIO22
  Top 0.254: RPI1.15 26.18,10.54 26.92,11.29 TP2.TP
GPIO23
  Top 0.254: RPI1.16 26.18,2.79 27.43,4.05 27.43,9.64 29.46,11.67 TP3.TP
GPIO24
  Top 0.254: RPI1.18 28.71,2.54 29.97,3.79 29.97,9.89 32,11.92 TP4.TP
GPIO25
  Top 0.254: RPI1.22 33.8,2.54 35.05,3.79 35.05,10.02 37.08,12.05 37.08,14.34 36.32,15.1 TP12.TP
GPIO26
  Top 0.254: RPI1.37 54.12,14.35 TP13.TP
GPIO27
  Top 0.254: RPI1.13 23.64,7.74 24.77,8.88 24.77,14.72 TP1.TP
HSYNC  (via drill 0.5)
  Top 0.254: R12.2 38.97,37.09 v38.99,37.58 | v13.46,9.51 RPI1.5
  Bottom 0.254: v13.46,9.51 13.46,18.78 20.57,25.89 20.57,37.07 21.59,38.09 37.97,38.09 v38.99,37.58
LEDK
  Top 0.254: J1.1 18.82,49.77
  Top 0.305: 18.82,49.77 16,49.77 14.86,50.91 8.89,50.91 7.62,49.64 7.62,49.07 D1.A 3.68,49.01 2.29,47.61 2.29,41.77 2.92,41.13 5.33,41.13 5.59,41.26
  Top 0.61: U3.3 8.48,35.55 7.62,35.55 6.99,36.18 C1.1 6.99,39.99 7.11,40.12 | R7.2 12.57,40.12 | 12.57,40.12 12.7,40.5 R2.2 | 12.57,40.12 9.14,40.12 | 9.14,40.12 7.11,40.12 | 7.11,40.12 6.48,40.62 5.59,41.26 R3.2 | R4.2 9.14,40.12
N$1
  Top 0.406: SJ1.2 R2.1
N$2
  Top 0.406: SJ2.2 R3.1
N$3
  Top 0.406: SJ3.2 R4.1
N$4  (via drill 0.5)
  Top 0.254: R8.7 22.71,45.81 24.64,47.74 24.71,47.92 J1.12 24.71,52.37 23.5,53.58 v22.61,53.58 | J1.6 21.71,51.28 v22.1,51.67
  Bottom 0.254: v22.1,51.67 22.1,53.07 v22.61,53.58
N$5
  Top 0.61: D2.A 14.22,34.17 L1.P$2 11.63,33.92 U3.1
N$6
  Top 0.254: R8.8 21.81,45.67 24.21,48.07 J1.11 24.21,51.98 23.62,52.56 21.46,52.56 21.21,52.31 J1.5
N$7
  Top 0.254: J1.10 23.71,48.33 21.72,46.34 21.46,46.34 21.08,45.96 21.08,45.45 20.95,45.32 20.44,45.32 R6.1
N$8
  Top 0.254: J1.9 23.21,48.59 21.59,46.98 21.34,46.98 20.7,46.34 19.68,46.34 19.43,46.09 19.43,45.43 R6.2
N$9
  Top 0.254: J1.8 22.71,48.85 21.46,47.61 21.21,47.61 20.45,46.85 19.3,46.85 18.67,46.21 18.67,45.43 R6.3
N$10
  Top 0.254: J1.7 22.21,49.12 21.34,48.24 21.08,48.24 20.32,47.48 18.92,47.48 17.78,46.34 17.78,45.44 R6.4
N$11
  Top 0.254: J1.15 26.21,48.54 23.51,45.85 R8.6
N$12
  Top 0.254: J1.16 26.71,48.28 24.41,45.99 R8.5
N$13
  Top 0.254: J1.17 27.21,48.02 25.91,46.72 25.91,45.44 R9.8
N$14
  Top 0.254: J1.18 27.71,47.76 26.78,46.83 R9.7
N$15
  Top 0.254: R9.6 27.58,46.87 28.21,47.49 J1.19 28.21,52.3 27.94,52.56 25.4,52.56 25.21,52.37 J1.13
N$16  (via drill 0.5)
  Top 0.254: R9.5 28.48,47.01 28.71,47.23 J1.20 28.71,52.69 27.94,53.45 v26.42,53.45 | J1.14 25.71,51.34 v26.04,51.67
  Bottom 0.254: v26.04,51.67 26.04,53.07 v26.42,53.45
N$17
  Top 0.254: J1.23 30.21,48.23 29.94,47.96 R10.8
N$18
  Top 0.254: J1.24 30.71,48.27 30.86,48.12 30.86,45.43 R10.7
N$19
  Top 0.254: J1.25 31.21,48.53 31.62,48.12 31.62,45.43 R10.6
N$20
  Top 0.254: J1.26 31.71,48.8 32.51,47.99 32.51,45.44 R10.5
N$21
  Top 0.254: R11.8 34.04,45.44 34.04,47.23 32.21,49.06 J1.27 32.21,52.23 31.88,52.56 29.34,52.56 29.21,52.43 J1.21
N$22  (via drill 0.5)
  Top 0.254: R11.7 34.92,45.43 34.92,47.1 32.71,49.32 J1.28 32.71,53 32.26,53.45 v30.23,53.45 | J1.22 29.71,51.53 v30.1,51.67
  Bottom 0.254: v30.1,51.67 30.1,53.2 v30.23,53.45
N$23
  Top 0.254: J1.30 33.71,49.08 35.69,47.1 37.59,47.1 38.1,46.59 38.1,45.44 R12.8
N$24
  Top 0.254: J1.32 34.71,48.84 35.81,47.74 37.97,47.74 38.99,46.72 38.99,45.43 R12.7
N$25
  Top 0.254: J1.33 35.21,49.11 35.94,48.37 38.73,48.37 39.75,47.36 39.75,45.43 R12.6
N$26
  Top 0.254: J1.34 35.71,49.37 36.2,48.88 39.12,48.88 40.64,47.36 40.64,45.44 R12.5
N$27
  Top 0.254: TP6.TP 9.14,22.97 D3.C
N$28  (via drill 0.5)
  Top 0.254: LED1.A 61.31,47.52 v61.21,47.61 | v52.83,44.69 52.78,44.63 IC1.5
  Bottom 0.254: v61.21,47.61 59.18,44.69 v52.83,44.69
N$29
  Top 0.254: LED1.C R13.2
N$31
  Top 0.254: R14.1 57.09,41.26 IC1.11
N$33
  Top 0.254: Y1.3 49.95,45.9 IC1.3
N$34
  Top 0.254: IC1.2 49.29,46.58 49.02,46.85 49.02,47.86 48.51,48.37 47.57,48.37 Y1.1
ON/OFF
  Top 0.254: J1.31 34.21,52.48 34.42,52.69 34.42,54.34 33.53,55.23 R5.1 9.14,55.23 4.06,50.15 2.54,50.15 1.52,49.13 1.52,39.23 | 6.35,32.75 6.35,15.35 TP5.TP
  Top 0.305: 1.52,39.23 2.03,38.72 4.57,38.72 5.84,37.45 5.84,33.26 6.35,32.75
PWM
  Top 0.305: R1.1 7.49,30.97 7.11,30.59 7.11,27.54 D3.A
  Top 0.61: U3.4 8.38,32.53 R1.1
R2
  Top 0.254: R6.5 17.75,27.83 22.73,22.72 46.61,22.72 50.29,19.16 50.29,3.79 51.58,2.51 RPI1.36
R3  (via drill 0.5)
  Top 0.254: R6.6 18.65,28.2 23.24,23.61 v24.64,23.61 | RPI1.11 20.95,6.29 20.95,7.99 21.72,8.75 v21.72,9.64
  Bottom 0.254: v24.64,23.61 24.64,12.56 v21.72,9.64
R4  (via drill 0.5)
  Top 0.254: R6.7 19.45,28.79 23.75,24.5 v25.91,24.5 | RPI1.12 21.09,2.66 22.35,3.92 22.35,8.24 v23.24,9.13
  Bottom 0.254: v25.91,24.5 25.91,11.8 v23.24,9.13
R5
  Top 0.254: R6.8 20.35,30.31 25.15,25.51 47.88,25.51 51.58,21.82 RPI1.35
R6
  Top 0.254: R8.1 21.81,30.24 25.4,26.66 49.91,26.66 56.52,20.05 56.52,11.8 55.37,10.65 55.37,3.92 54.12,2.66 RPI1.38
R7
  Top 0.254: R8.2 22.71,30.99 25.78,27.93 50.55,27.93 58.67,19.8 58.67,3.85 RPI1.40
VBUS  (via drill 0.5)
  Top 0.254: X1.VBUS 54.01,50.69 54.69,50.25 C4.1 | C3.1 48.19,44.12 49.36,45.28 IC1.4 51.39,45.28 51.56,45.45 51.56,47.1 51.44,47.23 IC1.1
  Top 0.305: 54.69,50.25 54.36,49.92 v54.36,49.64 | v50.67,48.37 50.23,47.93 IC1.1
  Bottom 0.305: v54.36,49.64 53.09,48.37 v50.67,48.37
VSYNC  (via drill 0.5)
  Top 0.254: R12.3 39.77,40.73 v40.01,40.5 | v11.18,9.38 11.18,6.39 RPI1.3
  Bottom 0.254: v40.01,40.5 39.88,40.24 38.48,38.72 21.08,38.72 19.81,37.45 19.81,26.4 11.18,17.77 v11.18,9.38
VUSB
  Top 0.254: IC1.17 59.03,45.28 C5.1
X+  (via drill 0.5)
  Top 0.254: IC1.7 50.02,43.29 51.18,43.29 52.32,42.15 v52.32,41.26 | v59.18,36.69 FB1.1
  Bottom 0.254: v52.32,41.26 56.9,36.69 v59.18,36.69
X-  (via drill 0.5)
  Top 0.254: FB3.1 v50.16,38.09 | v60.2,38.34 60.2,38.65 R14.2 58.8,39.67 58.8,38.34 58.67,38.21 56.39,38.21 55.88,38.72 55.88,42.53 56.68,43.33 IC1.14
  Bottom 0.254: v50.16,38.09 52.83,38.09 55.63,35.29 59.56,35.29 60.45,36.18 60.45,38.09 v60.2,38.34
XL
  Top 0.254: J1.39 38.21,53.81 38.86,54.47 42.04,54.47 42.55,53.96 42.55,46.72 42.04,46.21 42.04,36.81 45.21,33.64 49.28,33.64 50.29,34.66 FB3.2
XR
  Top 0.254: FB1.2 57.02,35.55 56.9,35.67 44.7,35.67 43.05,37.32 43.05,45.7 43.56,46.21 43.56,54.59 42.67,55.48 38.35,55.48 37.21,54.34 J1.37
Y+
  Top 0.254: IC1.15 57.16,43.93 56.26,43.93 54.74,42.4 FB2.1
Y-
  Top 0.254: IC1.16 55.7,44.63 53.72,42.66 53.72,39.1 52.32,37.7 FB4.1
YD  (via drill 0.5)
  Top 0.254: J1.38 37.71,54.07 38.61,54.98 42.42,54.98 43.05,54.34 43.05,46.47 42.55,45.96 42.55,37.07 44.83,34.78 v47.24,34.78 | v54.74,33.13 FB2.2
  Bottom 0.254: v47.24,34.78 53.47,34.4 v54.74,33.13
YU
  Top 0.254: J1.40 38.71,53.55 39.12,53.96 41.66,53.96 41.91,53.71 41.91,46.98 41.53,46.59 41.53,36.56 44.96,33.13 51.69,33.13 52.32,33.77 FB4.2

### Text on the board
tPlace: +25mA | +50mA | Backlight: 24V max CC / 25mA-125mA w/jumpers | AR1100 USB Touch | 40-Pin TTL Display Kippah | BACKLIT | On/Off | +5V | +3.3V | GND | GND | GND | #27 | #22 | #23 | #24 | #25 | #26
bPlace: Connect standard 40-pin / DPI / DotClock type Display | Opt. USB / Mouse / Touchscreen | Adjust constant-current / backlight by soldering / closed jumpers on other side | 40-Pin TTL Display Kippah / (w/optional touch screen control) | Note: Replaces the HDMI display out | Note: Uses Pi GPIO pins 2 thru 21